# Altium schematic sheet Gate Driver and Power Section.SchDoc: Gate Driver and Power Section
size B; Organization: UOE Racing; Address1: University of Ottawa; Address2: Camry; Address3: &; Address4: Nick M; DocumentNumber: 2020; Revision: A; SheetNumber: 3; SheetTotal: 4
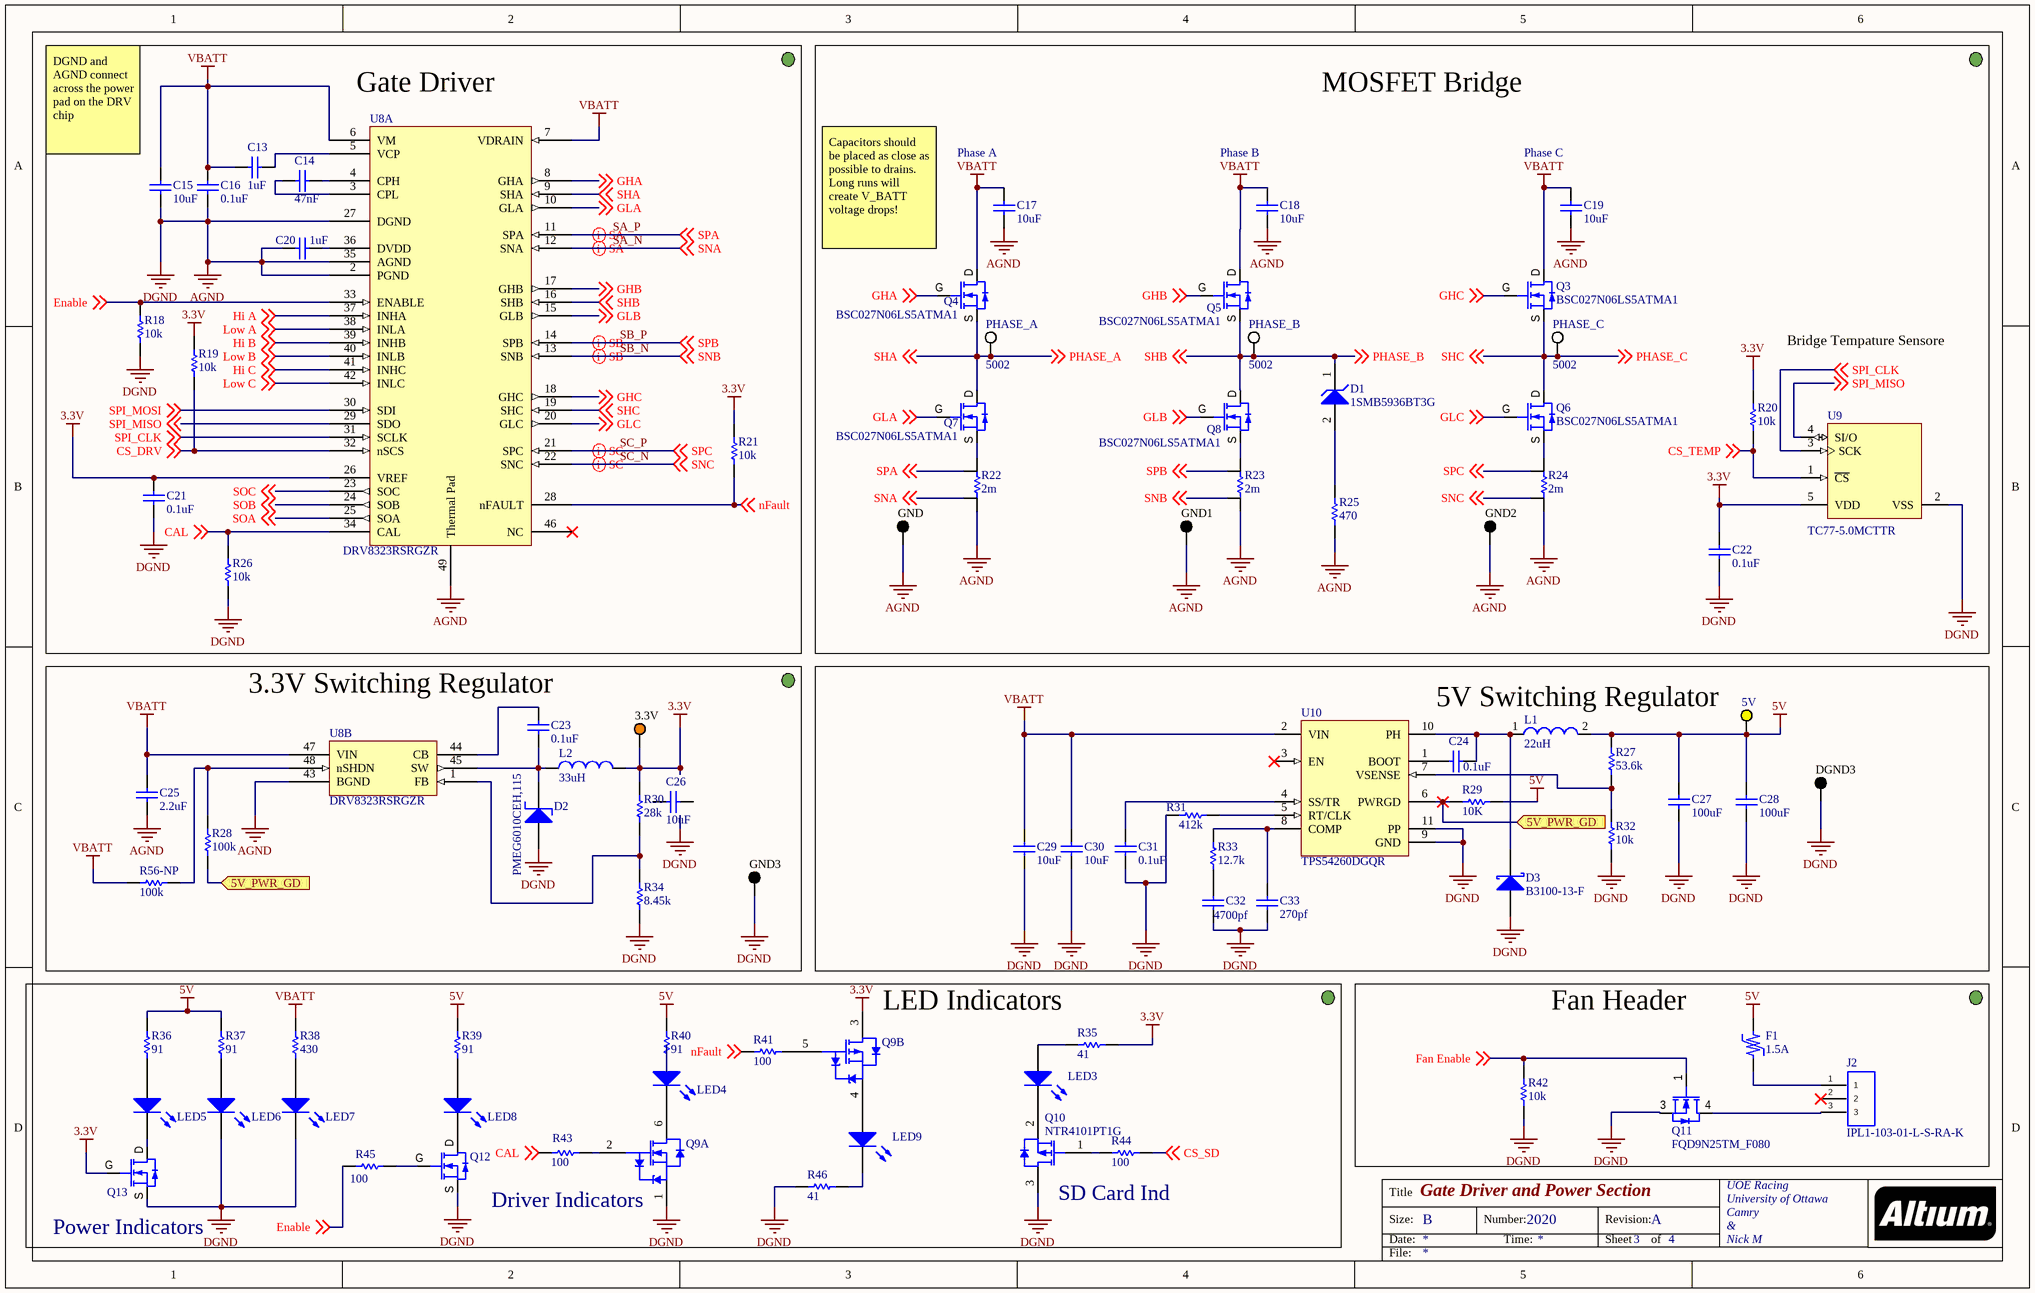
[diagram p0: Gate Driver and Power Section.SchDoc]

## Parts
3.3V  5013  [KSTN-5013_V]  (value not drawn)
5V  5004  [KSTN-5004]  (value not drawn)
C13  1uF  [CAPC1608X05L]
C14  47nF  [CAPC0603(1608)100_N]
C15  10uF  [CAPC5750X279X64LL40T39]
C16  0.1uF  [CAPC1608X05L]
C17  10uF  [CAPC5750X279X64NL40T39]
C18  10uF  [CAPC5750X279X64NL40T39]
C19  10uF  [CAPC5750X279X64NL40T39]
C20  1uF  [CAPC1608X05L]
C21  0.1uF  [CAPC1608X05L]
C22  0.1uF  [CAPC1608X05L]
C23  0.1uF  [CAPC1608X05L]
C24  0.1uF  [CAPC1608X05L]
C25  2.2uF  [CAPC3225X250X20LL40]
C26  10uF  [CAPC1608X05L]
C27  100uF  [MURA-1210_H_2.7_M]
C28  100uF  [MURA-1210_H_2.7_M]
C29  10uF  [TDK-C5750-2_L]
C30  10uF  [TDK-C5750-2_L]
C31  0.1uF  [CAPC1608X05L]
C32  4700pf  [CAPC1608X90X35ML10T15]
C33  270pf  [CAPC1608X90X35ML15T15]
D1  1SMB5936BT3G  [ONSC-SMB-2-403A-03_H_V]
D2  PMEG6010CEH,115  [SODFL350X120-2N]
D3  B3100-13-F  [DIOD-SMC-2_V]
DGND3  5011  [KSTN-5011_V]  (value not drawn)
F1  1.5A  [TECO-NANOSMDC150F-2_V]
GND  5011  [KSTN-5011_V]  (value not drawn)
GND1  5011  [KSTN-5011_V]  (value not drawn)
GND2  5011  [KSTN-5011_V]  (value not drawn)
GND3  5011  [KSTN-5011_V]  (value not drawn)
J2  IPL1-103-01-L-S-RA-K  [IPL1-103-01-XXX-S-RA]
L1  22uH  [WE-HCI-1365]
L2  33uH  [INDP8080X46L]
LED3  150060VS75000  [0603_A]  (value not drawn)
LED4  150080GS75000  [0805_A]  (value not drawn)
LED5  150080GS75000  [0805_A]  (value not drawn)
LED6  150080GS75000  [0805_A]  (value not drawn)
LED7  150080GS75000  [0805_A]  (value not drawn)
LED8  150080GS75000  [0805_A]  (value not drawn)
LED9  150060VS75000  [0603_A]  (value not drawn)
PHASE_A  5002  [KSTN-5002]
PHASE_B  5002  [KSTN-5002]
PHASE_C  5002  [KSTN-5002]
Q3  BSC027N06LS5ATMA1  [PG-TDSON-8-7]
Q4  BSC027N06LS5ATMA1  [PG-TDSON-8-7]
Q5  BSC027N06LS5ATMA1  [PG-TDSON-8-7]
Q6  BSC027N06LS5ATMA1  [PG-TDSON-8-7]
Q7  BSC027N06LS5ATMA1  [PG-TDSON-8-7]
Q8  BSC027N06LS5ATMA1  [PG-TDSON-8-7]
Q9  NX3008CBKV,115  [NXP-SOT666_M]  (value not drawn)  (parts A,B of 2)
Q10  NTR4101PT1G  [ONSC-SOT-23-3-318-08_V]
Q11  FQD9N25TM_F080  [DPAK229P991X239-3N]
Q12  DMN1019USN-7  [SOT95P285X140-3N]  (value not drawn)
Q13  DMN1019USN-7  [SOT95P285X140-3N]  (value not drawn)
R18  10k  [CAPC1608X05L]
R19  10k  [CAPC1608X05L]
R20  10k  [CAPC1608X05L]
R21  10k  [CAPC1608X05L]
R22  2m  [WSL27262L000FEB]
R23  2m  [WSL27262L000FEB]
R24  2m  [WSL27262L000FEB]
R25  470  [CAPC1608X05L]
R26  10k  [CAPC1608X05L]
R27  53.6k  [RESC1609X50X30ML10T20]
R28  100k  [CAPC1608X05L]
R29  10K  [RESC1608X55X25ML10T15]
R30  28k  [CAPC1608X05L]
R31  412k  [RESC1608X55X30LL15T15]
R32  10k  [RESC1609X55X30LL15T15]
R33  12.7k  [RESC1608X55X30LL15T15]
R34  8.45k  [CAPC1608X05L]
R35  41  [RESC1609X50X30ML10T20]
R36  91  [RESC1608X50X30NL20T20]
R37  91  [RESC1608X50X30NL20T20]
R38  430  [RESC1608X55X30LL20T10]
R39  91  [RESC1608X50X30NL20T20]
R40  91  [RESC1608X50X30NL20T20]
R41  100  [CAPC1608X05L]
R42  10k  [CAPC1608X05L]
R43  100  [CAPC1608X05L]
R44  100  [CAPC1608X05L]
R45  100  [CAPC1608X05L]
R46  41  [RESC1609X50X30ML10T20]
R56-NP  100k  [CAPC1608X05L]
U8  DRV8323RSRGZR  [QFN50P700X700X100_HS-49N]  (parts A,B of 2)
U9  TC77-5.0MCTTR  [SOT-23-CT5_N]
U10  TPS54260DGQR  [DGQ0010D_N]

## Blocks framed on the sheet
Gate Driver: C13-C16 C20 C21 R18 R19 R21 R26 U8
MOSFET Bridge: C17-C19 C22 D1 GND GND1 GND2 PHASE_A PHASE_B PHASE_C Q3-Q8 R20 R22-R25 U9
3.3V Switching Regulator: 3.3V C23 C25 C26 D2 GND3 L2 R28 R30 R34 R56-NP U8
5V Switching Regulator: 5V C24 C27-C33 D3 DGND3 L1 R27 R29 R31-R33 U10
LED Indicators: LED3-LED9 Q9 Q10 Q12 Q13 R35-R41 R43-R46
Fan Header: F1 J2 Q11 R42

## Ports
5V_PWR_GD (in)

## Nets
3.3V: 3.3V.1 C21.2 C22.2 L2.2 Q9.3(D2) Q13.G R19.2 R20.2 R21.2 R30.2 R35.1 U8.26(VREF) U9.5(VDD)
5V: 5V.1 C27.2 C28.2 F1.2 L1.2 R27.2 R29.2 R36.2 R37.2 R39.2 R40.2
AGND: C15.1 C16.1 C17.1 C18.1 C19.1 C20.1 C21.1 C22.1 C25.1 C27.1 C28.1 C29.1 C30.1 C31.1 C32.1 C33.1 D2.2(A) D3.1(A) DGND3.1 GND.1 GND1.1 GND2.1 GND3.1 LED6.1(K) LED7.1(K) Q9.1(S1) Q10.3(D) Q11.3(S) Q12.S Q13.S R18.1 R22.3 R23.3 R24.3 R25.2 R26.1 R31.1 R32.1 R34.1 R42.1 R46.2 U8.2(PGND) U8.27(DGND) U8.35(AGND) U8.43(BGND) U8.49(Thermal_Pad) U9.2(VSS) U10.9(GND) U10.11(PP)  [also labelled DGND]
VBATT: C13.1 C15.2 C16.2 C17.2 C18.2 C19.2 C25.2 C29.2 C30.2 Q3.D Q4.D Q5.D R38.2 R56-NP.1 U8.6(VM) U8.7(VDRAIN) U8.47(VIN) U10.2(VIN)
5V_PWR_GD: R28.1 R29.1 U10.6(PWRGD) ; port 5V_PWR_GD
CAL: R26.2 R43.1 U8.34(CAL) ; off-sheet CAL
CS_DRV: R19.1 U8.32(nSCS) ; off-sheet CS_DRV
CS_SD: R44.2 ; off-sheet CS_SD
CS_TEMP: R20.1 U9.1(~{CS}) ; off-sheet CS_TEMP
Enable: R18.2 R45.1 U8.33(ENABLE) ; off-sheet Enable
Fan Enable: Q11.1(G) R42.2 ; off-sheet Fan Enable
GHA: Q4.G U8.8(GHA) ; off-sheet GHA
GHB: Q5.G U8.17(GHB) ; off-sheet GHB
GHC: Q3.G U8.18(GHC) ; off-sheet GHC
GLA: Q7.G U8.10(GLA) ; off-sheet GLA
GLB: Q8.G U8.15(GLB) ; off-sheet GLB
GLC: Q6.G U8.20(GLC) ; off-sheet GLC
Hi A: U8.37(INHA) ; off-sheet Hi A
Hi B: U8.39(INHB) ; off-sheet Hi B
Hi C: U8.41(INHC) ; off-sheet Hi C
Low A: U8.38(INLA) ; off-sheet Low A
Low B: U8.40(INLB) ; off-sheet Low B
Low C: U8.42(INLC) ; off-sheet Low C
nFault: R21.1 R41.1 U8.28(nFAULT) ; off-sheet nFault
PHASE_A: PHASE_A.1 Q4.S Q7.D U8.9(SHA) ; off-sheet SHA, off-sheet PHASE_A  [also labelled SHA]
PHASE_B: D1.1(K) PHASE_B.1 Q5.S Q8.D U8.16(SHB) ; off-sheet SHB, off-sheet PHASE_B  [also labelled SHB]
PHASE_C: PHASE_C.1 Q3.S Q6.D U8.19(SHC) ; off-sheet SHC, off-sheet PHASE_C  [also labelled SHC]
SA_N: R22.4 U8.12(SNA) ; off-sheet SNA  [also labelled SNA]
SA_P: R22.2 U8.11(SPA) ; off-sheet SPA  [also labelled SPA]
SB_N: R23.4 U8.13(SNB) ; off-sheet SNB  [also labelled SNB]
SB_P: R23.2 U8.14(SPB) ; off-sheet SPB  [also labelled SPB]
SC_N: R24.4 U8.22(SNC) ; off-sheet SNC  [also labelled SNC]
SC_P: R24.2 U8.21(SPC) ; off-sheet SPC  [also labelled SPC]
SOA: U8.25(SOA) ; off-sheet SOA
SOB: U8.24(SOB) ; off-sheet SOB
SOC: U8.23(SOC) ; off-sheet SOC
SPI_CLK: U8.31(SCLK) U9.3(SCK) ; off-sheet SPI_CLK
SPI_MISO: U8.29(SDO) U9.4(SI/O) ; off-sheet SPI_MISO
SPI_MOSI: U8.30(SDI) ; off-sheet SPI_MOSI
NetC13_2: C13.2 U8.5(VCP)
NetC14_1: C14.1 U8.3(CPL)
NetC14_2: C14.2 U8.4(CPH)
NetC20_2: C20.2 U8.36(DVDD)
NetC23_1: C23.1 D2.1(K) L2.1 U8.45(SW)
NetC23_2: C23.2 U8.44(CB)
NetC24_1: C24.1 U10.1(BOOT)
NetC24_2: C24.2 D3.2(K) L1.1 U10.10(PH)
NetC31_2: C31.2 U10.4(SS/TR)
NetC32_2: C32.2 R33.2
NetC33_2: C33.2 R33.1 U10.8(COMP)
NetD1_2: D1.2(A) R25.1
NetF1_1: F1.1 J2.1
NetJ2_3: J2.3 Q11.4(D)
NetLED3_1: LED3.1(K) Q10.2(S)
NetLED3_2: LED3.2(A) R35.2
NetLED4_1: LED4.1(K) Q9.6(D1)
NetLED4_2: LED4.2(A) R40.1
NetLED5_1: LED5.1(K) Q13.D
NetLED5_2: LED5.2(A) R36.1
NetLED6_2: LED6.2(A) R37.1
NetLED7_2: LED7.2(A) R38.1
NetLED8_1: LED8.1(K) Q12.D
NetLED8_2: LED8.2(A) R39.1
NetLED9_1: LED9.1(K) R46.1
NetLED9_2: LED9.2(A) Q9.4(S2)
NetQ6_S: Q6.S R24.1
NetQ7_S: Q7.S R22.1
NetQ8_S: Q8.S R23.1
NetQ9_2: Q9.2(G1) R43.2
NetQ9_5: Q9.5(G2) R41.2
NetQ10_1: Q10.1(G) R44.1
NetQ12_G: Q12.G R45.2
NetR27_1: R27.1 R32.2 U10.7(VSENSE)
NetR28_2: R28.2 R56-NP.2 U8.48(nSHDN)
NetR30_1: R30.1 R34.2 U8.1(FB)
NetR31_2: R31.2 U10.5(RT/CLK)

Not connected (* = marked no-connect by the designer): C26 1 2; J2 2*; U8 46(NC)*; U10 3(EN)*

## Layout directives
differential pair; differential pair class SA: SA_N, SA_P
differential pair; differential pair class SB: SB_N, SB_P
differential pair; differential pair class SC: SC_N, SC_P

## Notes on the sheet
- (near C15) DGND and AGND connect across the power pad on the DRV chip
- (near C17) Phase A
- (near C18) Phase B
- (near C19) Phase C
- (near Q4) Capacitors should be placed as close as possible to drains. Long runs will create V_BATT voltage drops!
- Bridge Tempature Sensore
- (near Q13) Power Indicators
- (near Q9) Driver Indicators
- (near Q10) SD Card Ind
- Title
- Size:
- Date:
- B
- Number:
- Time:
- Revision:
- Sheet
- of
- File:

## Library data of the parts
3.3V = CMP-1672-00005-4: Test Point, Orange, Through Hole, RoHS, Bulk; Manufacturer: Keystone; REACH SVHC: No SVHC; ComponentLink2Description: Datasheet; PackageDescription: 1-Pin Through Hole Device, Dia 3.17 mm; Package Quantity: 100; PackageReference: 5013; Contact Material: Bronze; DatasheetVersion: Rev. F, 12/2013; ComponentLink2URL: http://www.keyelco.com/product-pdf.cfm?p=1322; Contact Plating: Silver; ComponentLink1URL: http://www.keyelco.com/; Packaging: Bulk; ComponentLink1Description: Manufacturer URL; Colour: Orange; Height: 8.12 mm; RoHSCompliant: True; Mount: Through Hole; Mounting Technology: Through Hole; ClassName: 3.3V Regulator
5V = CMP-2000-05575-1: Test Point, Yellow, 1-Pin THD, RoHS, Bulk; Manufacturer: Keystone; Package Description: 1-Pin Through Hole Device, Dia 2.54 mm; Manufacturer URL: http://www.keyelco.com/; Datasheet Version: Rev. G, 12/2008; Package Reference: 5004; Datasheet URL: http://www.keyelco.com/product-pdf.cfm?p=1313; Mounting Technology: ThroughHole; ClassName: 5V Regulator
C13 C20 = UMK107AB7105KA-T: CAP CER 1UF 50V X7R 0603; Manufacturer: Taiyo Yuden; Manufacturer Part Number: GMK107AB7105MAHT; Tolerance: 10%; Supplier 1: Digi-Key; Stock 1: 1780; Pricing 1: 1=0.29, 10=0.201, 100=0.1017, 500=0.0696, 1000=0.06158 (USD); Supplier 2: Digi-Key; Stock 2: 4000; Pricing 2: 1=0.29, 10=0.198, 100=0.1124, 500=0.07936, 1000=0.06943 (USD); Mount: Surface Mount; Case/Package: 0603; Case Code (Metric): 1608; Case Code (Imperial): 0603; Min Operating Temperature: -55°C; Max Operating Temperature: 125°C; Capacitance: 1uF; Packaging: Tape and Reel; Package Quantity: 1; Voltage Rating: 50V; Voltage Rating (DC): 50V; Dielectric: X7R; Termination: SMD/SMT; Length: 1.6mm; Height: 0.8mm; Width: 0.031inch; Thickness: 0.037inch; Depth: 0.8mm; Radiation Hardening: No; Halogen Free: Halogen Free; ComponentLink1URL: https://www.yuden.co.jp/productdata/catalog/mlcc_all_e.pdf; ComponentLink1Description: https://www.yuden.co.jp/productdata/catalog/mlcc_all_e.pdf
C14 = CMP-1035-02516-1: CAP 47nF 100V ±10% 0603 (1608 Metric) Thickness 1mm SMD; Case-Metric: 1608; Case-EIA: 0603; Tolerance: Â±10%; Rated Voltage: 100 V; Value: 47nF; Max Thickness: 1 mm; Technology: SMT
C15 C17-C19 = CMP-2000-07534-1: Chip Capacitor, 10 uF, +/- 20%, 100 V, -55 to 125 degC, 2220 (5750 Metric), RoHS, Tape and Reel; Manufacturer: AVX; Datasheet URL: http://datasheets.avx.com/X7RDielectric.pdf; Package Reference: 2220; Package Description: 2-Pin Surface Mount Device, Body 5 x 5.7 mm; Datasheet Version: 03/2017; Manufacturer URL: http://www.avx.com/; Mounting Technology: SurfaceMount
  C17-C19: ClassName: FETBridge
C16 = HMK107B7104KAHT: CAP ,MIDHIGH VOL,0603,100V,X7R,0.1UF 10% ,T&R; Manufacturer 1: Taiyo Yuden; Capacitance: 100nF; Supplier 1: Digi-Key; Manufacturer Part Number 1: HMK107B7104KAHT; Stock 1: 3336; Pricing 1: 1=0.21000, 10=0.14900, 100=0.06990, 500=0.04898, 1000=0.04055 (USD); RoHS: Yes; Mount: Surface Mount; Case/Package: 0603; Min Operating Temperature: -55°C; Max Operating Temperature: 125°C; Packaging: Tape and Reel; Voltage Rating: 100V; Tolerance: 10%; Length: 0.063inch; Width: 0.031inch; Thickness: 0.035inch; Ratings: AEC-Q200; ComponentLink1URL: http://ds.yuden.co.jp/TYCOMPAS/ut/detail.do?productNo=HMK107B7104KAHT&fileName=HMK107B7104KAHT_SS&mode=specSheetDownload&src-supplier=Digi-Key; ComponentLink1Description: http://ds.yuden.co.jp/TYCOMPAS/ut/detail.do?productNo=HMK107B7104KAHT&fileName=HMK107B7104KAHT_SS&mode=specSheetDownload&src-supplier=Digi-Key; ComponentLink2URL: http://www.yuden.co.jp/productdata/catalog/en/mlcc06_hq_e.pdf?src-supplier=Digi-Key; ComponentLink2Description: http://www.yuden.co.jp/productdata/catalog/en/mlcc06_hq_e.pdf?src-supplier=Digi-Key; ComponentLink3URL: https://ds.yuden.co.jp/TYCOMPAS/ut/detail?pn=HMK107B7104KAHT &amp;u=M&src-supplier=Digi-Key; ComponentLink3Description: https://ds.yuden.co.jp/TYCOMPAS/ut/detail?pn=HMK107B7104KAHT &amp;u=M&src-supplier=Digi-Key
C21-C24 C31 = CC0603JRX7R9BB104: Cap Ceramic 0.1uF 50V X7R 5% SMD 0603 125C Paper T/R; Manufacturer: Yageo; Capacitance: 100nF; Supplier 1: Digi-Key; Manufacturer Part Number: CC0603JRX7R9BB104; Stock 1: 40000; Pricing 1: 1=0.17, 10=0.12, 100=0.0562, 500=0.03942, 1000=0.03263 (USD); Mount: Surface Mount; Case/Package: 0603; Number of Pins: 2; Weight: 7.1E-05oz; Case Code (Imperial): 0603; Case Code (Metric): 1608; Min Operating Temperature: -55°C; Max Operating Temperature: 125°C; Tolerance: 5%; Dielectric: X7R; Voltage Rating: 50V; Packaging: Tape and Reel; Voltage Rating (DC): 50V; Termination: SMD/SMT; Composition: Ceramic; Length: 1.6mm; Height: 0.8mm; Width: 0.031inch; Thickness: 0.035inch; Depth: 0.8mm; Radiation Hardening: No; Lead Free: Lead Free; Halogen Free: Halogen Free; ComponentLink1URL: http://www.yageo.com/documents/recent/UPY-GPHC_X7R_6.3V-to-50V_8.pdf; ComponentLink1Description: http://www.yageo.com/documents/recent/UPY-GPHC_X7R_6.3V-to-50V_8.pdf
  C23: ClassName: 3.3V Regulator
  C24 C31: ClassName: 5V Regulator
C25 = CMP-2000-06053-1: Chip Capacitor, 2.2 uF, +/- 10%, -55 to 125 degC, 1210 (3225 Metric), RoHS, Tape and Reel; PCN Part Number: MLCCPartNumberChange30/Nov/2012; Manufacturer: TDK; Capacitance: 2.2µF; Catalog Drawings: CSERIES_1210_2.5; Product Training Modules: SEAT,CCV,andTVCLDesignToolsGuidetoReplacinganElectrolyticCapacitorwithanMLCC; Other Names: 445-4497-6; Voltage - Rated: 100V; Temperature Coefficient: X7R; Featured Product: C-SeriesMidVoltageMLCCs; Online Catalog: CSeries,MidVoltage; Ratings: -; Mounting Technology: SurfaceMount; Height - Seated (Max): -; Applications: GeneralPurpose; Packaging: Digi-Reel®; Mounting Type: SurfaceMount,MLCC; Lead Spacing: -; Thickness (Max): 0.098"(2.50mm); Package Reference: 1210 (3225 Metric); Manufacturer URL: http://www.tdk.com/; Size / Dimension: 0.126"Lx0.098"W(3.20mmx2.50mm); Operating Temperature: -55°C~125°C; Datasheet URL: https://datasheet.ciiva.com/15192/getdatasheetpartid-725361-15192330.pdf; RoHS Information: RoHSCertificate-MLCC; Lead Style: -; Standard Package: 1; Family: CeramicCapacitors; Datasheet Version: 10/2014; Category: Capacitors; Tolerance: ±10%; Features: -; Series: C; Package Description: 2-Pin Surface Mount Device, Body 3.2 x 2.5 mm; Package / Case: 1210(3225Metric)
C26 = CL10A106MQ8NNNC: Cap Ceramic 10uF 6.3V X5R 20% SMD 0603 85C Paper T/R; Manufacturer: Samsung; Supplier 1: Digi-Key; Manufacturer Part Number: CL10A106MQ8NNNC; Stock 1: 40000; Pricing 1: 1=0.15, 10=0.11, 100=0.0515, 500=0.03614, 1000=0.02992 (USD); Mount: Surface Mount; Case/Package: 0603; Case Code (Metric): 1608; Case Code (Imperial): 0603; Contact Plating: Tin; Min Operating Temperature: -55°C; Max Operating Temperature: 85°C; Capacitance: 10uF; Tolerance: 20%; Dielectric: X5R; Package Quantity: 1; Packaging: Tape and Reel; Voltage Rating: 6.3V; Voltage: 6.3V; Length: 1.6mm; Height: 0.8mm; Width: 0.031inch; Thickness: 0.035inch; Depth: 0.8mm; Radiation Hardening: No; ComponentLink1URL: http://www.samsungsem.com/kr/support/library/product-catalog/mlcc.jsp; ComponentLink1Description: http://www.samsungsem.com/kr/support/library/product-catalog/mlcc.jsp; ComponentLink2URL: https://www.verical.com/server-webapp/html/getDatasheet?partID=357557; ComponentLink2Description: https://www.verical.com/server-webapp/html/getDatasheet?partID=357557; ComponentLink3URL: http://www1.futureelectronics.com/doc/SAMSUNG%20PASSIVE/CL05B104KQ5NNNC.pdf; ComponentLink3Description: http://www1.futureelectronics.com/doc/SAMSUNG%20PASSIVE/CL05B104KQ5NNNC.pdf; ClassName: 3.3V Regulator
C27 C28 = CMP-2000-05259-1: CAP, Ceramic, 100 uF, 20%, 6.3 V, 1210, RoHS, Tape and Reel; Manufacturer: MurataElectronics; Dielectric: X5R; Voltage: 6.3Vdc; Product Depth: 2.5mm; Product Length: 3.2mm; Type: Flat; Rad Hard: No; Operating Temperature: -55to85degC; Datasheet URL: https://datasheet.ciiva.com/29199/455114-da-01-en-vs-kondensator-1210-29199468.pdf; Package/Case: 1210; Tolerance: 20%; Package Reference: 1210; Construction: Flat; Capacitance Value: 100uF; Datasheet Version: Dec-10; Product Height: 2.5mm; Package Description: 2-Pin Surface Mount Device, Body 3.2 x 2.5 mm; Mounting: SurfaceMount; Category: CapacitorCeramicMultilayer; Manufacturer URL: http://www.murata.com/; ClassName: 5V Regulator
C29 C30 = CMP-2000-06059-1: Chip Capacitor, 10 uF, +/- 20%, 100 V, -55 to 125 degC, 2220 (5750 Metric), RoHS, Tape and Reel; PCN Part Number: MLCCPartNumberChange30/Nov/2012; Manufacturer: TDK; Other Names: 445-5212-1; Featured Product: Compact,High-CapacitanceMultilayerCeramicChipCapacitorsMidVoltageX7S-100VMLCCsC-SeriesMidVoltageMLCCs; Product Training Modules: SEAT,CCV,andTVCLDesignToolsCSeriesMidVoltageCapacitorsFamilyGuidetoReplacinganElectrolyticCapacitorwithanMLCC; Kits: 445-9009-KIT-ND-KITCAPCERHICAP100V-630VSMDSAMPLEKIT1008-ND-KITCAPCERMLCC100V-630V; Catalog Drawings: CSERIES_2220_2.5; Online Catalog: CSeries,MidVoltage; Temperature Coefficient: X7S; Voltage - Rated: 100V; Capacitance: 10µF; Package Description: SMD, 2-Leads, Body 6.1 x 5.4 mm; Manufacturer URL: http://www.tdk.com/; Size / Dimension: 0.224"Lx0.197"W(5.70mmx5.00mm); RoHS Information: RoHSCertificate-MLCC; Package Reference: C5750-2; Applications: GeneralPurpose; Datasheet Version: 09/2013; Features: -; Datasheet URL: https://datasheet.ciiva.com/24216/c5750x7s2a106m230kb-265716-24216594.pdf; Standard Package: 1; Lead Spacing: -; Family: CeramicCapacitors; Thickness (Max): 0.098"(2.50mm); Packaging: CutTape(CT); Mounting Technology: SurfaceMount; Lead Style: -; Height - Seated (Max): -; Package / Case: 2220(5750Metric); Series: C; Category: Capacitors; Ratings: -; Operating Temperature: -55°C~125°C; Mounting Type: SurfaceMount,MLCC; Tolerance: ±20%; ClassName: 5V Regulator
C32 = CMP-2006-02483-1: Part Number: GRM188R72A472KA01D; Manufacturer: Murata; ClassName: 5V Regulator
C33 = CMP-2006-02064-1: Manufacturer: AVX Interconnect / Elco; Part Number: 06035C271KAT2A; ClassName: 5V Regulator
D1 = CMP-1060-00146-1: 3 W Zener Voltage Regulator, 2-Pin SMB, Pb-Free, Tape and Reel; Manufacturer: On Semiconductor; VZ Typ (V): 30; ComponentLink2Description: Datasheet; ComponentLink1Description: Manufacturer URL; Packing: Tape and Reel; ComponentLink1URL: http://www.onsemi.com/; ComponentLink2URL: http://www.onsemi.com/pub_link/Collateral/1SMB5913BT3-D.PDF; ComponentLink3Description: Package Specification; PackageReference: SMB-2-403A-03_H; RoHS: Pb-Free; PackageDescription: 2-Pin Small Molded Package, J-Bend Lead, Body 4.33 x 3.625 mm; PackageVersion: Rev. H, 05/2011; PartNumber: 1SMB5936BT3G; ComponentLink3URL: http://www.onsemi.com/pub_link/Collateral/1SMB5913BT3-D.PDF; DatasheetVersion: Rev. 8; Mounting Technology: Surface Mount; ClassName: FETBridge
D2 = PMEG6010CEH,115: NEXPERIA - PMEG6010CEH,115 - DIODE, SCHOTTKY, 1A, 60V, SOD-123F; Supplier 1: Digi-Key; Manufacturer 1: Nexperia; Manufacturer Part Number 1: PMEG6010CEH,115; Stock 1: 154416; Pricing 1: 1=0.46000, 10=0.34400, 100=0.21410, 500=0.14650, 1000=0.11269 (USD); RoHS: No; ComponentLink1URL: https://www.mouser.com/ds/2/302/PMEG6010CEH_PMEG6010CEJ-102368.pdf?src-supplier=Mouser; ComponentLink1Description: https://www.mouser.com/ds/2/302/PMEG6010CEH_PMEG6010CEJ-102368.pdf?src-supplier=Mouser; ComponentLink2URL: http://www.farnell.com/datasheets/109684.pdf?src-supplier=Farnell; ComponentLink2Description: http://www.farnell.com/datasheets/109684.pdf?src-supplier=Farnell; ComponentLink3URL: https://assets.nexperia.com/documents/data-sheet/PMEG6010CEH_PMEG6010CEJ.pdf?src-supplier=Digi-Key; ComponentLink3Description: https://assets.nexperia.com/documents/data-sheet/PMEG6010CEH_PMEG6010CEJ.pdf?src-supplier=Digi-Key; ClassName: 3.3V Regulator
D3 = CMP-2000-05889-1: High Voltage Schottky Barrier Rectifier, 100 V, 3 A, -55 to 125 degC, 2-Pin SMD, RoHS, Tape and Reel; Manufacturer: DiodesIncorporated; Vf - Forward Voltage: 0.79V; If - Forward Current: 3A; Ir - Reverse Current: 500uA; Unit Weight: 0.007408oz; Vrrm - Repetitive Reverse Voltage: 100V; Configuration: Single; Ifsm - Forward Surge Current: 100A; Packaging: Reel; Mounting Technology: SurfaceMount; Package / Case: SMC; Package Reference: SMC; Manufacturer URL: http://www.diodes.com/; Factory Pack Quantity: 3000; Brand: DiodesIncorporated; RoHS: True; Type: SchottkyBarrierRectifier; Height: 2.5mm; Operating Temperature Range: -55Cto+125C; Length: 7.11mm; Series: B3100; Mounting Style: SMD/SMT; Width: 6.22mm; Maximum Operating Temperature: +125C; Product Category: SchottkyDiodes&Rectifiers; Termination Style: SMD/SMT; Package Description: 2-Pin Surface Mount Device, Body 5.905 x 6.855 mm; Datasheet Version: Rev. 13-2, 09/2010; Minimum Operating Temperature: -55C; Datasheet URL: http://www.diodes.com/_files/datasheets/ds30020.pdf; Product: SchottkyDiodes; Technology: Si; ClassName: 5V Regulator
DGND3 GND GND1-GND3 = CMP-1672-00003-4: Test Point, Black, Through Hole, RoHS, Bulk; Manufacturer: Keystone; ComponentLink2URL: http://www.keyelco.com/product-pdf.cfm?p=1320; Colour: Black; Pins: 1; REACH SVHC: No SVHC; ComponentLink1URL: http://www.keyelco.com/; PackageReference: 5011; Contact Plating: Silver; Package Quantity: 100; Packaging: Bulk; RoHSCompliant: true; Height: 8.12 mm; PackageDescription: 1-Pin Through Hole Device, Dia 3.17 mm; Mount: Through Hole; Mounting Technology: Through Hole; DatasheetVersion: Rev. F, 12/2013; ComponentLink1Description: Manufacturer URL; Contact Material: Bronze; ComponentLink2Description: Datasheet
  DGND3: ClassName: 5V Regulator
  GND GND1 GND2: ClassName: FETBridge
F1 = CMP-2000-06806-1: PolySwitch Resettable Device, 6 V, 1.5 A, -40 to 85 degC, 2-Pin SMD, RoHS, Tape and Reel; Part No: NANOSMDC150F-2; Manufacturer: TEConnectivity/CircuitProtection; Agency Approvals: CSA,TUV,UL; Maximum Trip Time: 0.3@8As; Lead Diameter: N/R; Maximum Current Rating: 100A; Trip Current: 3A; Maximum Voltage Rating: 6VDC; Typical Power Dissipation: 0.8(Max)W; Minimum Initial Resistance: 0.04Ohm; Maximum Post Trip Resistance: 0.11Ohm; RoHS: Yes; Dimension: 3.4(Max)x1.8(Max)x0.89(Max)mm; Datasheet URL: http://www.te.com/commerce/DocumentDelivery/DDEController?Action=showdoc&DocId=Catalog+Section%7FCLP00010%7FA%7Fpdf%7FEnglish%7FENG_CS_CLP00010_A_CLP00010.pdf%7FRF1359-000; Manufacturer URL: http://www.te.com/; Datasheet Version: 11/2013; Package Description: 2-Pin Surface Mount Device, Body 3.2 x 1.585 mm; Family: NANOSMD; Applications: N/A; Packaging: TapeandReel; Mounting: SurfaceMount; Seated Plane Height: N/R; Package Reference: NANOSMDC150F-2; Package/Case: 1206; Wire Form: N/R; Number of Terminals: 2; Hold Current: 1.5A; Terminal Pitch: N/A; Maximum Initial Resistance: N/A; Operating Temperature: 85(Max)C; Mounting Technology: SurfaceMount
J2 = IPL1-103-01-L-S-RA-K: CONN HEADER R/A 3POS 2.54MM; Manufacturer 1: Samtec; Max Current Rating: 7.4A; Number of Contacts: 3; Number of Ports: 1; Max Voltage Rating (AC): 675V; Gender: Male; Supplier 1: Digi-Key; Manufacturer Part Number 1: IPL1-103-01-L-S-RA-K; Stock 1: 209; Pricing 1: 1=2.59000, 10=2.34700, 100=2.01180, 500=1.67650, 1000=1.43700, 5000=1.27414 (USD); RoHS: Yes; Mount: Through Hole; Contact Material: Bronze; Contact Plating: Gold; Number of Terminals: 3; Housing Material: Polymer; Min Operating Temperature: -55°C; Max Operating Temperature: 125°C; Termination: Solder; Orientation: Right Angle; Packaging: Bulk; Length: 9.14mm; Pitch: 2.54mm; Depth: 9.65mm; Radiation Hardening: No; ComponentLink1URL: http://www.farnell.com/datasheets/2607185.pdf?src-supplier=Farnell; ComponentLink1Description: http://www.farnell.com/datasheets/2607185.pdf?src-supplier=Farnell; ComponentLink2URL: http://components.arrow.com/part/dataview/0323_03818136?src-supplier=Arrow+Europe; ComponentLink2Description: http://components.arrow.com/part/dataview/0323_03818136?src-supplier=Arrow+Europe; ComponentLink3URL: http://www.samtec.com/documents/webfiles/pdf/ipl1.pdf?src-supplier=Avnet+Europe; ComponentLink3Description: http://www.samtec.com/documents/webfiles/pdf/ipl1.pdf?src-supplier=Avnet+Europe; ComponentLink4URL: http://www.samtec.com/documents/webfiles/pdf/ipl1.pdf?src-supplier=Avnet; ComponentLink4Description: http://www.samtec.com/documents/webfiles/pdf/ipl1.pdf?src-supplier=Avnet; ComponentLink5URL: http://www.farnell.com/datasheets/2607185.pdf?src-supplier=Newark; ComponentLink5Description: http://www.farnell.com/datasheets/2607185.pdf?src-supplier=Newark; ComponentLink6URL: http://suddendocs.samtec.com/prints/ipl1-1xx-xx-xxx-s-xx-x-xx-mkt.pdf?src-supplier=Digi-Key; ComponentLink6Description: http://suddendocs.samtec.com/prints/ipl1-1xx-xx-xxx-s-xx-x-xx-mkt.pdf?src-supplier=Digi-Key
L1 = CMP-0226-00043-1: SMD Flat Wire High Current Inductor WE-HCI, L=22.0 µH; Inductance: 22.0 ÂµH; ComponentLink1URL: http://www.we-online.com; ComponentLink2Description: Datasheet; PackageVersion: 2008; PackageReference: WE-HCI-1365; DatasheetVersion: ver 1, Aug-2009; PackageDescription: Inductor, 2-Leads, Body 13.2 x 12.8 mm; ComponentLink1Description: Manufacturer Link; ComponentLink2URL: http://www.we-online.de/katalog/media/pdf/7443551221.pdf; ClassName: 5V Regulator
L2 = SRU8043-330Y: Fixed Inductors 33uH 30% SMD 8043; Manufacturer 1: Bourns; Core Material: Ferrite; DC Resistance (DCR): 100mR; Max DC Current: 1.7A; Saturation Current: 1.4A; Shielding: Shielded; Self Resonant Frequency: 11MHz; Q Factor: 21; Test Frequency: 100kHz; Supplier 1: Digi-Key; Manufacturer Part Number 1: SRU8043-330Y; Stock 1: 3183; Pricing 1: 1=0.97000, 10=0.89700, 100=0.64860, 500=0.49680 (USD); RoHS: Yes; Mount: Surface Mount; Case/Package: Nonstandard; Number of Pins: 2; Min Operating Temperature: -40°C; Max Operating Temperature: 125°C; Tolerance: 30%; Inductance: 33uH; Packaging: Tape and Reel; Package Quantity: 1000; Current Rating: 1.7A; Composition: Wirewound; Termination: SMD/SMT; DC Current: 1.7A; Military Standard: Not; Length: 0.315inch; Height: 0.169inch; Width: 0.315inch; Height - Seated (Max): 0.181inch; Depth: 8.3mm; ComponentLink1URL: https://datasheet.ciiva.com/4959/sru8043-34397-4959893.pdf?src-supplier=Mouser; ComponentLink1Description: https://datasheet.ciiva.com/4959/sru8043-34397-4959893.pdf?src-supplier=Mouser; ComponentLink2URL: https://datasheet.ciiva.com/6708/sru8043-6708554.pdf?src-supplier=Digi-Key; ComponentLink2Description: https://datasheet.ciiva.com/6708/sru8043-6708554.pdf?src-supplier=Digi-Key; ComponentLink3URL: https://datasheet.ciiva.com/48684/sru8043-48684874.pdf?src-supplier=Avnet; ComponentLink3Description: https://datasheet.ciiva.com/48684/sru8043-48684874.pdf?src-supplier=Avnet; ComponentLink4URL: https://datasheet.ciiva.com/41680/70887-41680748.pdf?src-supplier=Newark; ComponentLink4Description: https://datasheet.ciiva.com/41680/70887-41680748.pdf?src-supplier=Newark; ClassName: 3.3V Regulator
LED3 LED9 = CMP-1426-00006-1: SMD mono-color Chip LED, WL-SMCW, Bright Green; Manufacturer: Wuerth Elektronik; ComponentLink2URL: http://katalog.we-online.com/led/datasheet/150060VS75000.pdf; ComponentLink1Description: Manufacturer URL; PackageReference: 0603_A; PartNumber: 150060VS75000; ComponentLink2Description: Datasheet; ComponentLink1URL: http://www.we-online.com; Color: Bright Green
LED4-LED8 = CMP-1426-00007-1: SMD mono-color Chip LED, WL-SMCW, Green; Manufacturer: Wuerth Elektronik; PackageReference: 0805_A; Color: Green; PartNumber: 150080GS75000; ComponentLink2URL: http://katalog.we-online.com/led/datasheet/150080GS75000.pdf; ComponentLink1URL: http://www.we-online.com; ComponentLink1Description: Manufacturer URL; ComponentLink2Description: Datasheet
PHASE_A PHASE_B PHASE_C = CMP-2000-05182-1: Test Point, White, 1-Pin THD, RoHS, Bulk; Manufacturer: KeystoneElectronics; Outside Diameter: 2.54mm; Plating: Silver; Mounting Hole Size: 1mm; Product: TestPoints; Packaging: Bulk; Manufacturer URL: http://www.keyelco.com/; Length: 7.62mm; Datasheet Version: Rev. G, 12/2008; Type: Miniature; Product Category: CircuitBoardHardware-PCB; Material: Nylon; RoHS: True; Contact Material: PhosphorBronze; Datasheet URL: https://ciiva.com/datasheet-click-2917627?src=ciiva&sig=bd195616; Color: White; Brand: KeystoneElectronics; ClassName: FETBridge
Q3-Q8 = BSC027N06LS5ATMA1: MOSFET N-CH 60V 100A 8TDSON; Manufacturer 1: Infineon; Supplier 1: Digi-Key; Manufacturer Part Number 1: BSC027N06LS5ATMA1; Stock 1: 3937; Pricing 1: 1=2.07000, 10=1.85900, 100=1.49430, 500=1.22768, 1000=1.01722 (USD); RoHS: No; ComponentLink1URL: https://www.infineon.com/dgdl/Infineon-BSC027N06LS5-DS-v02_00-EN.pdf?fileId=5546d46258fc0bc101596e1c881234d6&src-supplier=Digi-Key; ComponentLink1Description: https://www.infineon.com/dgdl/Infineon-BSC027N06LS5-DS-v02_00-EN.pdf?fileId=5546d46258fc0bc101596e1c881234d6&src-supplier=Digi-Key; ClassName: FETBridge
  Q3: Parameter 1: *
Q9 = CMP-1259-00353-1: N/P-Channel Trench MOSFET, 30 / -30 V, 400 / -220 mA, -55 to 150 degC, 6-Pin SOT666, Tape and Reel; Manufacturer: NXP Semiconductors; Channel Type: N/P; Automotive Qualified: Y; Packing: Tape & Reel; ComponentLink2URL: http://www.nxp.com/documents/data_sheet/NX3008CBKV.pdf; ComponentLink1Description: Manufacturer URL; ComponentLink3Description: Package Specification; PartNumber: NX3008CBKV,115; PackageReference: SOT666; DatasheetVersion: Rev. 1; ComponentLink3URL: http://www.nxp.com/documents/outline_drawing/sot666_po.pdf; Mounting Technology: Surface Mount; ComponentLink1URL: http://www.nxp.com/; ComponentLink2Description: Datasheet; PackageVersion: 06-03-16, 03/2006; PackageDescription: 6-Pin Small Outline Transistor Package, Body 1.6 x 1.2 mm, Pitch 0.5 mm
Q10 = CMP-1058-00754-1: Trench Power MOSFET, -20 V, Single P-Channel, 3-Pin SOT-23, Pb-Free, Tape and Reel; Manufacturer: On Semiconductor; Crss Typ (pF): 75; VGS(th) Max (V): 1.2; VGS Max (V): 8; V(BR)DSS Min (V): 20; Channel Polarity: P Channel; Ciss Typ (pF): 675; Coss Typ (pF): 100; Qrr Typ (nC): 1008; ID Max (A): 3.2; ComponentLink2URL: http://www.onsemi.cn/pub_link/Collateral/NTR4101P-D.PDF; Package Type: SOT-23-3; Packing: Tape and Reel; ComponentLink3Description: Package Specification; ComponentLink1Description: Manufacturer URL; PackageDescription: 3-Pin Small Outline Transistor, Body 2.92 x 1.3 mm, Pitch 0.95 mm; ComponentLink3URL: http://www.onsemi.cn/pub_link/Collateral/318-08.PDF; ComponentLink2Description: Datasheet; PartNumber: NTR4101PT1G; Configuration: Single; Mounting Technology: Surface Mount; ComponentLink1URL: http://www.onsemi.com/; PackageVersion: Rev. AP, 11/2009; RoHS: Pb-Free; DatasheetVersion: Rev. 9; PackageReference: SOT-23-3-318-08
Q11 = FQD9N25TM_F080: Trans MOSFET N-CH 250V 7.4A 3-Pin(2+Tab) DPAK T/R; Manufacturer: ON Semiconductor / Fairchild; Rise Time: 105ns; Fall Time: 45ns; Turn-Off Delay Time: 25ns; Turn-On Delay Time: 13ns; Gate to Source Voltage (Vgs): 30V; Rds On Max: 420mR; Input Capacitance: 700pF; Max Power Dissipation: 2.5W; Element Configuration: Single; Supplier 1: Digi-Key; Manufacturer Part Number: FQD9N25TM_F080; Stock 1: 2322; Pricing 1: 1=1.77, 10=1.563, 100=1.2355, 500=0.95816, 1000=0.75644 (USD); Mount: Surface Mount; Case/Package: TO-252-3; Number of Pins: 3; Weight: 0.26037g; Min Operating Temperature: -55°C; Max Operating Temperature: 150°C; Continuous Drain Current (ID): 7.4A; Package Quantity: 2500; Packaging: Tape and Reel; Drain to Source Voltage (Vdss): 250V; Drain to Source Breakdown Voltage: 250V; Power Dissipation: 2.5W; Drain to Source Resistance: 420mR; Radiation Hardening: No; ComponentLink1URL: https://www.fairchildsemi.com/tape-and-reel-drawings/PKG-TO252A03.pdf; ComponentLink1Description: https://www.fairchildsemi.com/tape-and-reel-drawings/PKG-TO252A03.pdf; ComponentLink2URL: https://www.fairchildsemi.com/datasheets/FQ/FQD9N25.pdf; ComponentLink2Description: https://www.fairchildsemi.com/datasheets/FQ/FQD9N25.pdf
Q12 Q13 = DMN1019USN-7: MOSFET N-CH 12V 9.3A SC59; Manufacturer 1: Diodes; Capacitance: 2.426E-09F; Rds On Max: 10mR; Input Capacitance: 2.426nF; Max Power Dissipation: 680mW; Element Configuration: Single; Number of Channels: 1; Drain to Source Resistance: 41mR; Gate to Source Voltage (Vgs): 4.5V; Fall Time: 16.8ns; Rise Time: 57.6ns; Turn-Off Delay Time: 22.2ns; Turn-On Delay Time: 7.6ns; Supplier 1: Digi-Key; Manufacturer Part Number 1: DMN1019USN-7; Stock 1: 30621; Pricing 1: 1=0.44000, 10=0.35400, 100=0.24130, 500=0.18096, 1000=0.13572 (USD); RoHS: Yes; Mount: Surface Mount; Case/Package: TO-236-3; Weight: 0.000282oz; Min Operating Temperature: -55°C; Max Operating Temperature: 150°C; Packaging: Tape and Reel; Drain to Source Voltage (Vdss): 12V; Continuous Drain Current (ID): 9.3A; Drain to Source Breakdown Voltage: 12V; Package Quantity: 3000; Lead Free: Lead Free; ComponentLink1URL: http://www.mouser.com/ds/2/115/DMN1019USN-336718.pdf?src-supplier=Mouser; ComponentLink1Description: http://www.mouser.com/ds/2/115/DMN1019USN-336718.pdf?src-supplier=Mouser; ComponentLink2URL: https://www.diodes.com/assets/Datasheets/DMN1019USN.pdf?src-supplier=Digi-Key; ComponentLink2Description: https://www.diodes.com/assets/Datasheets/DMN1019USN.pdf?src-supplier=Digi-Key
R18-R21 R26 R42 = RR0816P-103-D: RES SMD 10K OHM 0.5% 1/16W 0816; Manufacturer: Susumu; Resistance: 10kR; Power Rating: 63mW; Voltage Rating: 75V; Temperature Coefficient: 25ppm/°C; Supplier 1: Digi-Key; Manufacturer Part Number: RR0816P-103-D; Stock 1: 1031099; Pricing 1: 1=0.11, 10=0.098, 100=0.0376, 1000=0.01654, 2500=0.01428 (USD); Case/Package: 0603; Number of Pins: 2; Weight: 7.1E-05oz; Case Code (Imperial): 0603; Case Code (Metric): 1608; Min Operating Temperature: -55°C; Max Operating Temperature: 125°C; Packaging: Tape and Reel; Tolerance: 0.5%; Package Quantity: 1; Termination: SMD/SMT; Composition: Thin Film; Number of Terminations: 2; Max Power Dissipation: 63mW; Voltage Rating (DC): 75V; Length: 1.6mm; Height: 0.4mm; Width: 0.8mm; Depth: 0.8mm; REACH SVHC: Unknown; Lead Free: Lead Free; ComponentLink1URL: http://documents.rs-components.com/techlib://itc_doclist_GB.htm?stockno=3915321; ComponentLink1Description: http://documents.rs-components.com/techlib://itc_doclist_GB.htm?stockno=3915321; ComponentLink2URL: http://www.susumu.co.jp/common/pdf/n_catalog_partition05_en.pdf; ComponentLink2Description: http://www.susumu.co.jp/common/pdf/n_catalog_partition05_en.pdf
R22-R24 = WSL27262L000FEB: RES SMD 2 MOHM 1% 3W 2726; Manufacturer 1: Vishay Dale; Resistance: 2mR; Temperature Coefficient: 75ppm/°C; Supplier 1: Digi-Key; Manufacturer Part Number 1: WSL27262L000FEB; Stock 1: 5164; Pricing 1: 1=2.51000, 10=2.22300, 25=2.06160, 50=1.94040, 100=1.69790, 250=1.45532, 500=1.21276 (USD); RoHS: Yes; Case/Package: 2726; Case Code (Imperial): 2726; Case Code (Metric): 6966; Min Operating Temperature: -65°C; Max Operating Temperature: 170°C; Packaging: Tape and Reel; Power Rating: 3W; Tolerance: 1%; Package Quantity: 1000; Termination: SMD/SMT; Composition: Metal Strip; Length: 6.9mm; Height: 3mm; Width: 6.6mm; ComponentLink1URL: http://www.mouser.com/ds/2/427/wsl2726-88189.pdf?src-supplier=Mouser; ComponentLink1Description: http://www.mouser.com/ds/2/427/wsl2726-88189.pdf?src-supplier=Mouser; ComponentLink2URL: https://media.digikey.com/pdf/Data%20Sheets/Vishay%20Dale%20PDFs/WSL_C_N_F_H_R_Series_EB_Pkg.pdf?src-supplier=Digi-Key; ComponentLink2Description: https://media.digikey.com/pdf/Data%20Sheets/Vishay%20Dale%20PDFs/WSL_C_N_F_H_R_Series_EB_Pkg.pdf?src-supplier=Digi-Key; ComponentLink3URL: http://www.vishay.com/docs/30131/wsl2726.pdf?src-supplier=Digi-Key; ComponentLink3Description: http://www.vishay.com/docs/30131/wsl2726.pdf?src-supplier=Digi-Key; ClassName: FETBridge
R25 = RC0603JR-07470RL: RES SMD 470 OHM 5% 1/10W 0603; Manufacturer: Yageo; Resistance: 470R; Temperature Coefficient: 100ppm/°C; Voltage Rating (DC): 50V; Power Rating: 100mW; Supplier 1: Digi-Key; Manufacturer Part Number: RC0603JR-07470RL; RoHS: Yes; Stock 1: 12870080; Pricing 1: 1 = 0.10000, 10 = 0.02000, 100 = 0.00810, 1000 = 0.00362, 2500 = 0.00314 (USD); Case/Package: 0603; Number of Pins: 2; Case Code (Imperial): 0603; Case Code (Metric): 1608; Min Operating Temperature: -55°C; Max Operating Temperature: 155°C; Tolerance: 5%; Composition: Thick Film; Packaging: Tape and Reel; Voltage Rating: 50V; Package Quantity: 1; Termination: SMD/SMT; Number of Terminations: 2; Military Standard: Not; Max Power Dissipation: 100mW; Features: Moisture Resistant; Length: 0.063inch; Height: 0.022inch; Width: 0.031inch; Depth: 0.8mm; REACH SVHC: No SVHC; Lead Free: Lead Free; ComponentLink1URL: http://www.yageo.com/documents/recent/PYu-RC_Group_51_RoHS_L_10.pdf; ComponentLink1Description: http://www.yageo.com/documents/recent/PYu-RC_Group_51_RoHS_L_10.pdf; ComponentLink2URL: http://www.farnell.com/datasheets/443971.pdf; ComponentLink2Description: http://www.farnell.com/datasheets/443971.pdf; ClassName: FETBridge
R27 = CMP-2000-03454-1: Manufacturer: Vishay Dale; Part Number: CRCW060353K6FKEA; ClassName: 5V Regulator
R28 R56-NP = CR0603-JW-104ELF: BOURNS - CR0603-JW-104ELF - RES, 100K, 5%, 0.1W, 0603, THICK FILM; Resistance: 100kR; Power Rating: 100mW; Voltage Rating: 50V; Temperature Coefficient: 200ppm/°C; Supplier 1: Digi-Key; Manufacturer 1: Bourns; Manufacturer Part Number 1: CR0603-JW-104ELF; Stock 1: 49390; Pricing 1: 1=0.10000, 10=0.01500, 25=0.01080, 50=0.00840, 100=0.00610, 250=0.00468, 500=0.00374, 1000=0.00275 (USD); RoHS: Yes; Mount: Surface Mount; Case/Package: 0603; Number of Pins: 2; Case Code (Imperial): 0603; Case Code (Metric): 1608; Contact Plating: Tin; Min Operating Temperature: -55°C; Max Operating Temperature: 155°C; Packaging: Tape and Reel; Tolerance: 5%; Package Quantity: 5000; Composition: Thick Film; Termination: SMD/SMT; Working Voltage: 50V; Military Standard: Not; Voltage Rating (DC): 50V; Length: 1.6mm; Height: 0.45mm; Width: 0.8mm; Depth: 0.8mm; Thickness: 457um; Radiation Hardening: No; REACH SVHC: No SVHC; ComponentLink1URL: https://datasheet.ciiva.com/22713/691949-22713239.pdf?src-supplier=Element14; ComponentLink1Description: https://datasheet.ciiva.com/22713/691949-22713239.pdf?src-supplier=Element14; ComponentLink2URL: https://datasheet.ciiva.com/23776/1902866-23776391.pdf?src-supplier=Newark; ComponentLink2Description: https://datasheet.ciiva.com/23776/1902866-23776391.pdf?src-supplier=Newark; ComponentLink3URL: https://datasheet.ciiva.com/16766/70154685-16766760.pdf?src-supplier=Allied+Electronics; ComponentLink3Description: https://datasheet.ciiva.com/16766/70154685-16766760.pdf?src-supplier=Allied+Electronics; ComponentLink4URL: https://datasheet.ciiva.com/9120/chpreztr-9120764.pdf?src-supplier=Avnet; ComponentLink4Description: https://datasheet.ciiva.com/9120/chpreztr-9120764.pdf?src-supplier=Avnet; ComponentLink5URL: https://datasheet.ciiva.com/46383/1791942-46383790.pdf?src-supplier=Element14; ComponentLink5Description: https://datasheet.ciiva.com/46383/1791942-46383790.pdf?src-supplier=Element14; ComponentLink6URL: https://datasheet.ciiva.com/30229/159chpreztr-30229129.pdf?src-supplier=Onlinecomponents.com; ComponentLink6Description: https://datasheet.ciiva.com/30229/159chpreztr-30229129.pdf?src-supplier=Onlinecomponents.com; ComponentLink7URL: https://datasheet.ciiva.com/16935/chpreztr-16935963.pdf?src-supplier=Avnet+Europe; ComponentLink7Description: https://datasheet.ciiva.com/16935/chpreztr-16935963.pdf?src-supplier=Avnet+Europe; ComponentLink8URL: https://datasheet.ciiva.com/5543/chpreztr-5543676.pdf?src-supplier=Mouser; ComponentLink8Description: https://datasheet.ciiva.com/5543/chpreztr-5543676.pdf?src-supplier=Mouser; ComponentLink9URL: https://datasheet.ciiva.com/48692/001055501-da-01-en-smd-wid-cr0603-jw-104elf-100k-ohm-1-10w-48692133.pdf?src-supplier=Conrad; ComponentLink9Description: https://datasheet.ciiva.com/48692/001055501-da-01-en-smd-wid-cr0603-jw-104elf-100k-ohm-1-10w-48692133.pdf?src-supplier=Conrad
  R28: ClassName: 3.3V Regulator
R29 = CMP-2000-05022-1: Resistor, 10 KOhm, +/- 5%, 100 mW, -55 to 155 degC, 0603 (1608 Metric), RoHS, Tape and Reel; Manufacturer: Yageo; Resistance: 10kOhms; Voltage Rating: 50V; Temperature Coefficient: 100PPM/C; Power Rating: 100mW; Package Reference: 603; Series: RC; Case Code - mm: 1608; Packaging: Reel; Datasheet URL: http://www.farnell.com/datasheets/443971.pdf; Datasheet Version: Rev. 4, 04/2009; Operating Temperature Range: -55Cto+155C; Product: ThickFilmResistorsGeneralPurpose; Package Description: 2-Pin Surface Mount Device, Body 1.6 x 0.8 mm; Manufacturer URL: http://www.yageo.com/; Case Code - in: 0603; Tolerance: 5%; Termination Style: SMD/SMT; ClassName: 5V Regulator
R30 = RMCF0603FT28K0: RES SMD 28K OHM 1% 1/10W 0603; Manufacturer 1: Stackpole Electronics; Resistance: 28kR; Power Rating: 100mW; Temperature Coefficient: 100ppm/°C; Supplier 1: Digi-Key; Manufacturer Part Number 1: RMCF0603FT28K0; Stock 1: 126187; Pricing 1: 1=0.10000, 10=0.01700, 100=0.00680, 1000=0.00306, 2500=0.00266 (USD); RoHS: Yes; Mount: Surface Mount; Case/Package: 0603; Case Code (Metric): 1608; Case Code (Imperial): 0603; Contact Plating: Tin,Matte; Min Operating Temperature: -55°C; Max Operating Temperature: 155°C; Tolerance: 1%; Packaging: Tape and Reel; Composition: Thick Film; Number of Terminations: 2; Max Power Dissipation: 100mW; Features: Automotive AEC-Q200; Length: 0.061inch; Height: 0.022inch; Width: 0.031inch; Radiation Hardening: No; Lead Free: Lead Free; ComponentLink1URL: https://www.seielect.com/Catalog/SEI-RMCF_RMCP.pdf?src-supplier=Digi-Key; ComponentLink1Description: https://www.seielect.com/Catalog/SEI-RMCF_RMCP.pdf?src-supplier=Digi-Key; ComponentLink2URL: https://www.seielect.com/catalog/SEI-Packaging.pdf?src-supplier=Digi-Key; ComponentLink2Description: https://www.seielect.com/catalog/SEI-Packaging.pdf?src-supplier=Digi-Key; ComponentLink3URL: http://components.arrow.com/part/dataview/50505137S2698N1174?src-supplier=Arrow; ComponentLink3Description: http://components.arrow.com/part/dataview/50505137S2698N1174?src-supplier=Arrow; ComponentLink4URL: https://www.seielect.com/catalog/SEI-RMCF_RMCP.pdf?src-supplier=Avnet; ComponentLink4Description: https://www.seielect.com/catalog/SEI-RMCF_RMCP.pdf?src-supplier=Avnet; ComponentLink5URL: http://www.seielect.com/Catalog/SEI-RMC.pdf?src-supplier=Future+Electronics; ComponentLink5Description: http://www.seielect.com/Catalog/SEI-RMC.pdf?src-supplier=Future+Electronics; ClassName: 3.3V Regulator
R31 = CMP-2000-00492-1: Manufacturer: Panasonic; Part Number: ERJ-3EKF4123V; ClassName: 5V Regulator
R32 = CMP-2000-07452-1: Chip Resistor, 10 KOhm, +/- 1%, 0.1 W, -55 to 155 degC, 0603 (1608 Metric), RoHS, Tape and Reel; Manufacturer: Panasonic; Voltage Rating: 75V; Case\/Package: 0603; Power Rating: 100mW; Resistance: 10KOhm; Temperature Coefficient: 100ppm\/degreesC; Number of Pins: 2; Package Reference: 603; Depth: 0.8mm; Mount: SurfaceMount; Package Description: 2-Pin Surface Mount Device, Body 1.6 x 0.85 mm; Datasheet Version: 02/2017; Length: 1.6mm; Lead Free: LeadFree; Height: 0.45mm; Number of Terminations: 2; Max Power Dissipation: 100mW; Min Operating Temperature: -55degC; Datasheet URL: https://industrial.panasonic.com/cdbs/www-data/pdf/RDA0000/AOA0000C304.pdf; Termination: SMD/SMT; Case Code (Metric): 1608; Case Code (Imperial): 0603; Tolerance: 1%; Max Operating Temperature: 155degC; RoHSCompliant: true; Voltage Rating (DC): 75V; Radiation Hardening: No; Packaging: TapeandReel; Composition: ThickFilm; Mounting Technology: SurfaceMount; Manufacturer URL: http://www.panasonic.com/; Width: 0.031inch; REACH SVHC: NoSVHC; Contact Plating: Tin; Military Standard: Not; Package Quantity: 1; ClassName: 5V Regulator
R33 = CMP-2000-00228-1: Manufacturer: Panasonic; Part Number: ERJ-3EKF1272V; ClassName: 5V Regulator
R34 = RC0603FR-078K45L: RES SMD 8.45K OHM 1% 1/10W 0603; Manufacturer 1: Yageo; Resistance: 8.45kR; Power Rating: 100mW; Voltage Rating: 50V; Temperature Coefficient: 100ppm/°C; Supplier 1: Digi-Key; Manufacturer Part Number 1: RC0603FR-078K45L; Stock 1: 1203753; Pricing 1: 1=0.10000, 10=0.02400, 100=0.00970, 1000=0.00437, 2500=0.00379 (USD); RoHS: Yes; Case/Package: Molded; Case Code (Imperial): 0603; Case Code (Metric): 1608; Min Operating Temperature: -55°C; Max Operating Temperature: 155°C; Tolerance: 1%; Packaging: Tape and Reel; Termination: SMD/SMT; Military Standard: Not; Composition: Thick Film; Voltage Rating (DC): 50V; Length: 1.6mm; Depth: 0.8mm; Lead Free: Lead Free; ComponentLink1URL: http://www.mouser.com/ds/2/447/RC0603-272842.pdf?src-supplier=Mouser; ComponentLink1Description: http://www.mouser.com/ds/2/447/RC0603-272842.pdf?src-supplier=Mouser; ComponentLink2URL: http://components.arrow.com/part/dataview/0323_03543311?src-supplier=Arrow+Europe; ComponentLink2Description: http://components.arrow.com/part/dataview/0323_03543311?src-supplier=Arrow+Europe; ComponentLink3URL: https://www.verical.com/server-webapp/html/getDatasheet?partID=329317&src-supplier=Verical; ComponentLink3Description: https://www.verical.com/server-webapp/html/getDatasheet?partID=329317&src-supplier=Verical; ComponentLink4URL: http://www.yageo.com/documents/recent/PYu-RC_Group_51_RoHS_L_9.pdf?src-supplier=Digi-Key; ComponentLink4Description: http://www.yageo.com/documents/recent/PYu-RC_Group_51_RoHS_L_9.pdf?src-supplier=Digi-Key; ComponentLink5URL: http://www.yageo.com/documents/recent/PYu-RC0603_51_RoHS_L_7.pdf?src-supplier=Future+Electronics; ComponentLink5Description: http://www.yageo.com/documents/recent/PYu-RC0603_51_RoHS_L_7.pdf?src-supplier=Future+Electronics; ClassName: 3.3V Regulator
R35 R46 = CMP-2000-03356-1: Manufacturer: Vishay Dale; Part Number: CRCW060343R0JNEA
R36 R37 R39 R40 = CMP-2000-01951-1: Part Number: RG1608N-910-B-T5; Manufacturer: Susumu
R38 = CMP-2000-00986-1: Part Number: RK73B1JTTD431J; Manufacturer: KOA Speer
R41 R43-R45 = RR0816P-101-D: RES SMD 100 OHM 0.5% 1/16W 0816; Manufacturer: Susumu; Resistance: 100R; Power Rating: 63mW; Voltage Rating: 75V; Temperature Coefficient: 25ppm/°C; Supplier 1: Digi-Key; Manufacturer Part Number: RR0816P-101-D; RoHS: Yes; Stock 1: 167672; Pricing 1: 1 = 0.11000, 10 = 0.09800, 100 = 0.03760, 1000 = 0.01654, 2500 = 0.01428 (USD); Case/Package: 0603; Number of Pins: 2; Weight: 7.1E-05oz; Case Code (Metric): 1608; Case Code (Imperial): 0603; Min Operating Temperature: -55°C; Max Operating Temperature: 125°C; Package Quantity: 1; Tolerance: 0.5%; Packaging: Cut Tape; Composition: Thin Film; Number of Terminations: 2; Termination: SMD/SMT; Max Power Dissipation: 63mW; Voltage Rating (DC): 75V; Length: 1.6mm; Height: 0.4mm; Width: 0.031inch; Depth: 0.8mm; REACH SVHC: Unknown; Lead Free: Lead Free; ComponentLink1URL: http://www.susumu.co.jp/common/pdf/n_catalog_partition05_en.pdf; ComponentLink1Description: http://www.susumu.co.jp/common/pdf/n_catalog_partition05_en.pdf; ComponentLink2URL: http://documents.rs-components.com/techlib://itc_doclist_GB.htm?stockno=3915191; ComponentLink2Description: http://documents.rs-components.com/techlib://itc_doclist_GB.htm?stockno=3915191
U8 = DRV8323RSRGZR: IC 3PHASE GATE DRIVER 48VQFN; Manufacturer: Texas Instruments; Supplier 1: Digi-Key; Manufacturer Part Number: DRV8323RSRGZR; Stock 1: 5951; Pricing 1: 1=4.44, 10=3.991, 100=3.2698, 500=2.78356, 1000=2.34758 (USD); Min Operating Temperature: -40°C; Max Operating Temperature: 125°C; Supplier 2: Digi-Key; Manufacturer 2: Texas Instruments; Manufacturer Part Number 2: DRV8323RSRGZR; Stock 2: 7391; Pricing 2: 1=4.44000, 10=3.99100, 100=3.26980, 500=2.78356, 1000=2.34758 (USD); RoHS: No; ComponentLink1URL: http://www.ti.com/lit/ds/symlink/drv8323r.pdf?src-supplier=Digi-Key; ComponentLink1Description: http://www.ti.com/lit/ds/symlink/drv8323r.pdf?src-supplier=Digi-Key
U9 = CMP-0192-00172-1: Thermal Sensor with SPI Interface, 5-Pin SOT-23, -55°C to +125°C Temperature, Tape and Reel; PackageVersion: revBB, Aug-2009; DatasheetVersion: revA, Aug-2002; PackageDescription: 5-Lead Plastic Small Outline Transistor (CT) [SOT-23]; Code_IPC: SOT23-5; PackageReference: SOT-23-CT5
U10 = CMP-0323-00512-3: Buck Inverting Buck-Boost Step Down Regulator with 3.5 to 60 V Input and 0.8 to 58 V Output, -40 to 150 degC, 10-Pin MSOP-PowerPAD (DGQ), Green (RoHS & no Sb/Br); Manufacturer: Texas Instruments; Vout(Min)(V): 0.8; Regulated Outputs(#): 1; Vin(Min)(V): 3.5; Topology: Buck, Inverting Buck-Boost; Vin(Max)(V): 60; Iq(Typ)(mA): 0.138; SubFamily: Step-Down Regulator; Vout(Max)(V): 58; Rating: Catalog; Iout(Max)(A): 2.5; Duty Cycle(Max)(%): 98; PartNumber: TPS54260DGQR; ComponentLink2Description: Package Specification; ComponentLink3Description: URL Link1; ComponentLink3URL: Samples URL:http://www.ti.com/product/tps54260#samples; ComponentLink1URL: http://www.ti.com/general/docs/lit/getliterature.tsp?genericPartNumber=TPS54260&fileType=pdf; ComponentLink2URL: http://www.ti.com/lit/ml/mpds043e/mpds043e.pdf; PackageReference: DGQ0010D; PackageDescription: 10-Pin PowerPAD Plastic Small Outline 0.5 mm Pitch, Exposed Pad; ComponentLink1Description: Datasheet; PackageVersion: revF, Nov-2011; Mounting Technology: Surface Mount; Eco-Plan: Green (RoHS & no Sb/Br); Code_JEDEC: MO-187-BA-T; DatasheetVersion: SLVSA86A; Switch Current Limit(Typ)(A): 3.5; ClassName: 5V Regulator